# EAGLE design Кроватная подсветка3 (EAGLE 6.1)
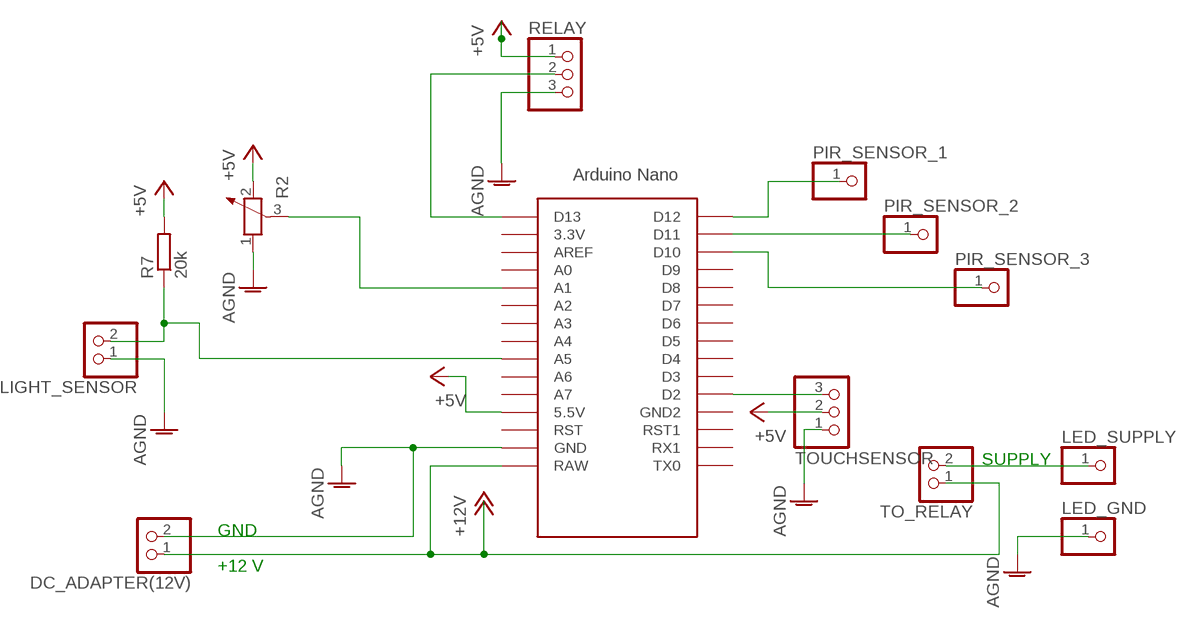
[diagram p0: schematic, sheet 1]

## Parts
DC_ADAPTER(12V)  PINHD-1X2  [1X02]
LED_GND  PINHD-1X1  [1X01]
LED_SUPPLY  PINHD-1X1  [1X01]
LIGHT_SENSOR  PINHD-1X2  [1X02]
PIR_SENSOR_1  PINHD-1X1  [1X01]
PIR_SENSOR_2  PINHD-1X1  [1X01]
PIR_SENSOR_3  PINHD-1X1  [1X01]
R2  POTENTIOMETER_PT-10S  [PT-10S]
R7  20k  R-EU_0207/10  [0207/10]
RELAY  PINHD-1X3  [1X03]
TO_RELAY  PINHD-1X2  [1X02]
TOUCHSENSOR  PINHD-1X3  [1X03]
U$1  NANO  [NANO]

## Nets
+5V: R2.2 R7.2 RELAY.1 TOUCHSENSOR.2 U$1.5V(5.5V)
AGND: DC_ADAPTER(12V).2 LED_GND.1 LIGHT_SENSOR.1 R2.1 RELAY.3 TOUCHSENSOR.1 U$1.GND
N$1: LIGHT_SENSOR.2 R7.1 U$1.A5
N$2: PIR_SENSOR_1.1 U$1.D12
N$3: RELAY.2 U$1.D13
N$4: TOUCHSENSOR.3 U$1.D2
N$5: LED_SUPPLY.1 TO_RELAY.2
N$6: DC_ADAPTER(12V).1 TO_RELAY.1 U$1.RAW
N$7: PIR_SENSOR_2.1 U$1.D11
N$10: PIR_SENSOR_3.1 U$1.D10
N$11: R2.3 U$1.A1
Unconnected: U$1.3.3V U$1.A0 U$1.A2 U$1.A3 U$1.A4 U$1.A6 U$1.A7 U$1.AREF U$1.D3 U$1.D4 U$1.D5 U$1.D6 U$1.D7 U$1.D8 U$1.D9 U$1.GND1(GND2) U$1.ICSP1 U$1.ICSP2 U$1.ICSP3 U$1.ICSP4 U$1.ICSP5 U$1.ICSP6 U$1.RST U$1.RST1 U$1.RX1 U$1.TX0

## Notes on the sheet
- SUPPLY
- GND
- +12 V

## Library data of the parts
DC_ADAPTER(12V) LIGHT_SENSOR TO_RELAY = pinhead:PINHD-1X2: PIN HEADER
LED_GND LED_SUPPLY PIR_SENSOR_1-PIR_SENSOR_3 = pinhead:PINHD-1X1: PIN HEADER
R2 = rcl:POTENTIOMETER_: Potentiometer
R7 = resistor:R-EU_: RESISTOR, European symbol
RELAY TOUCHSENSOR = pinhead:PINHD-1X3: PIN HEADER
U$1 = Arduino-clone:NANO: Arduino Nano

## Board
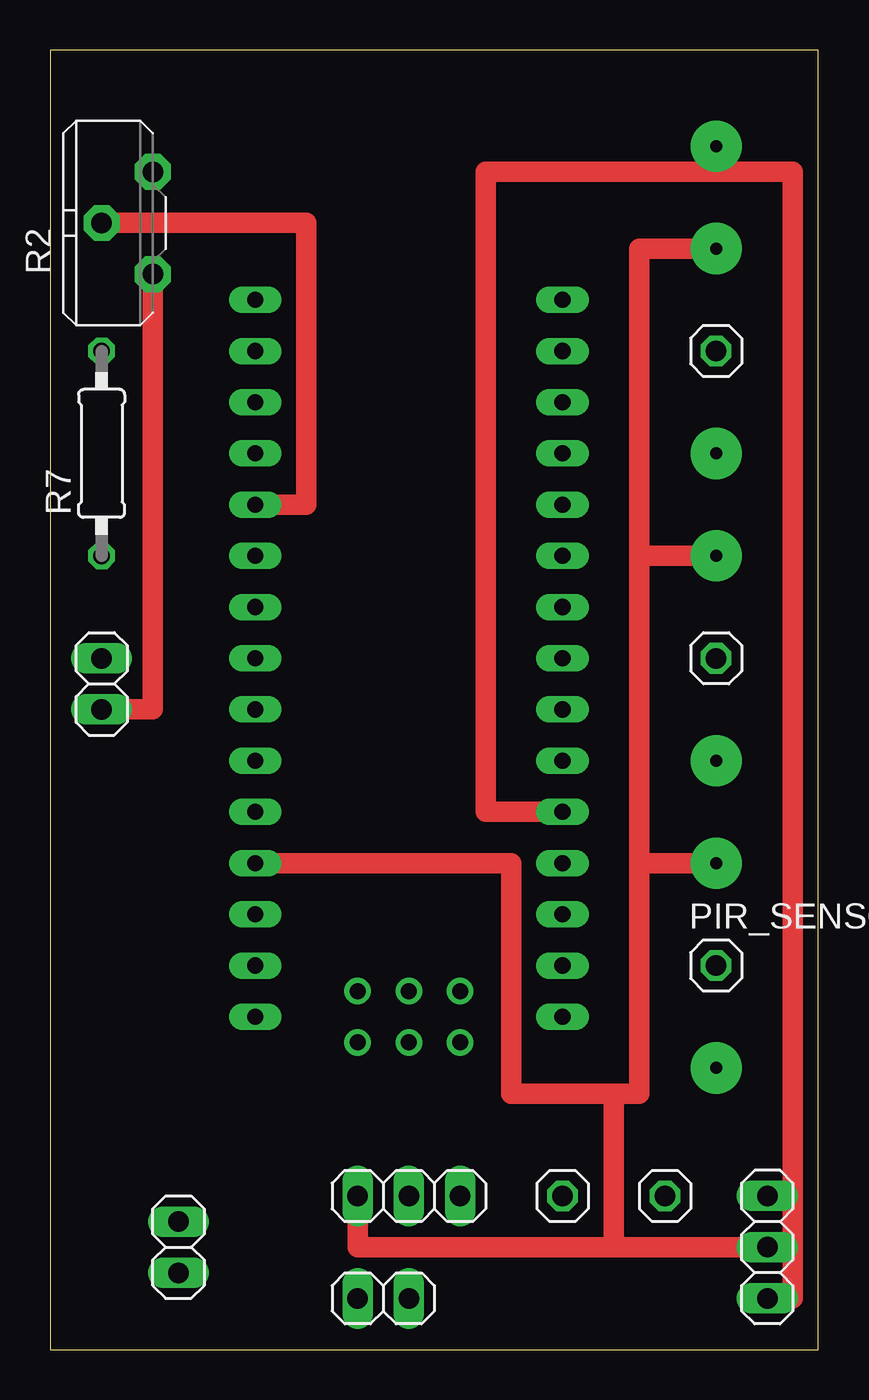
[diagram p1: board, top side]
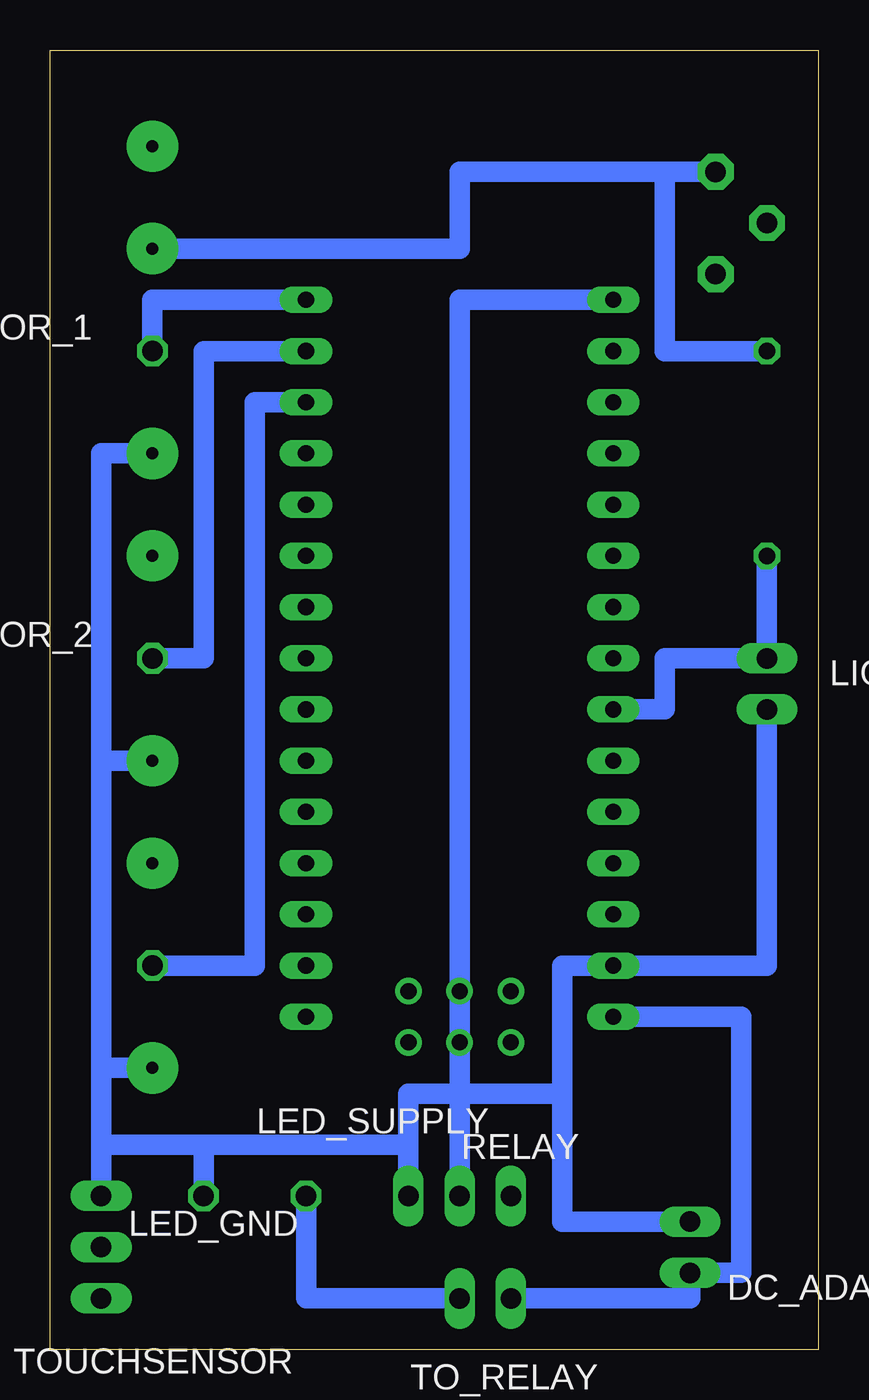
[diagram p2: board, bottom side, seen from below]

Size 38.08 x 64.44 mm. Coordinates in mm from the lower left corner, seen from the top.
Outline: 0,0 38.08,0 38.08,64.44 0,64.44 0,0
Copper layers (1*16): Top 0.035mm / dielectric 1.5mm / Bottom 0.035mm
Design rules: minimum track width 10mil, minimum drill 24mil, track to track 8mil, track to pad 8mil, pad to pad 8mil, via to via 8mil, smd to smd 8mil, copper to edge 40mil, drill to drill 8mil, minimum pad ring 10mil, minimum via ring 8mil, stop-mask expansion 4mil, vias tented up to drill 0mil, thermal gap 10mil

### Footprints (pad centres in the part's own frame; a part is rotated, then mirrored left to right if it is on the bottom)
1X02 = drill 1.016 long: 1 -1.27,0; 2 1.27,0
1X01 = drill 1.016 octagon: 1 0,0
PT-10S = drill 1.016 pad 1.778 octagon: 1 -2.54,-1.27; 2 2.54,-1.27; 3 0,1.27
0207/10 = drill 0.813 octagon: 1 -5.08,0; 2 5.08,0
1X03 = drill 1.016 long: 1 -2.54,0; 2 0,0; 3 2.54,0
NANO = drill 0.8 long: 3.3V -10.16,24.13; 5V -10.16,-1.27; A0 -10.16,19.05; A1 -10.16,16.51; A2 -10.16,13.97; A3 -10.16,11.43; A4 -10.16,8.89; A5 -10.16,6.35; A6 -10.16,3.81; A7 -10.16,1.27; AREF -10.16,21.59; D2 5.08,1.27; D3 5.08,3.81; D4 5.08,6.35; D5 5.08,8.89; D6 5.08,11.43; D7 5.08,13.97; D8 5.08,16.51; D9 5.08,19.05; D10 5.08,21.59; D11 5.08,24.13; D12 5.08,26.67; D13 -10.16,26.67; GND -10.16,-6.35; GND1 5.08,-1.27; RAW -10.16,-8.89; RST -10.16,-3.81; RST1 5.08,-3.81; RX1 5.08,-6.35; TX0 5.08,-8.89 | drill 0.8: ICSP1 -5.08,-10.16; ICSP2 -5.08,-7.62; ICSP3 -2.54,-10.16; ICSP4 -2.54,-7.62; ICSP5 0,-10.16; ICSP6 0,-7.62

### Placement (x,y rotation side)
DC_ADAPTER(12V)  6.35,5.08 90 top
LED_GND  30.48,7.62 0 top
LED_SUPPLY  25.4,7.62 0 top
LIGHT_SENSOR  2.54,33.02 90 top
PIR_SENSOR_1  33.02,49.53 0 top
PIR_SENSOR_2  33.02,34.29 0 top
PIR_SENSOR_3  33.02,19.05 0 top
R2  3.81,55.88 90 top
R7  2.54,44.45 90 top
RELAY  17.78,7.62 0 top
TO_RELAY  16.51,2.54 0 top
TOUCHSENSOR  35.56,5.08 270 top
U$1  20.32,25.4 0 top

### Tracks (layer width: path | path; a pad name or v marks a point on that pad's centre or on a via)
+5V  (via drill 0.6 pad 2.54)
  Top 1.016: 29.21,39.37 29.21,54.61 v33.02,54.61 | 29.21,39.37 29.21,24.13 | 29.21,24.13 29.21,12.7 27.94,12.7 | 27.94,12.7 22.86,12.7 22.86,24.13 U$1.5V | RELAY.1 15.24,5.08 27.94,5.08 | 27.94,5.08 27.94,12.7 | v33.02,24.13 29.21,24.13 | v33.02,39.37 29.21,39.37 | TOUCHSENSOR.2 27.94,5.08
  Bottom 1.016: R7.2 7.62,49.53 7.62,58.42 | R2.2 7.62,58.42 | 7.62,58.42 17.78,58.42 17.78,54.61 v33.02,54.61
AGND  (via drill 0.6 pad 2.54)
  Top 1.016: R2.1 5.08,31.75 LIGHT_SENSOR.1
  Bottom 1.016: 12.7,12.7 12.7,19.05 U$1.GND 2.54,19.05 LIGHT_SENSOR.1 | 12.7,12.7 12.7,6.35 DC_ADAPTER(12V).2 | RELAY.3 20.32,10.16 | 12.7,12.7 20.32,12.7 20.32,10.16 | 20.32,10.16 30.48,10.16 | 30.48,10.16 35.56,10.16 | 35.56,10.16 35.56,13.97 | 35.56,13.97 35.56,29.21 | 35.56,29.21 35.56,44.45 v33.02,44.45 | v33.02,13.97 35.56,13.97 | v33.02,29.21 35.56,29.21 | LED_GND.1 30.48,10.16 | TOUCHSENSOR.1 35.56,10.16
N$1
  Bottom 1.016: R7.1 LIGHT_SENSOR.2 7.62,34.29 7.62,31.75 U$1.A5
N$2
  Bottom 1.016: PIR_SENSOR_1.1 33.02,52.07 U$1.D12
N$3
  Bottom 1.016: U$1.D13 17.78,52.07 RELAY.2
N$4
  Top 1.016: U$1.D2 21.59,26.67 21.59,58.42 36.83,58.42 36.83,2.54 TOUCHSENSOR.3
N$5
  Bottom 1.016: TO_RELAY.2 25.4,2.54 LED_SUPPLY.1
N$6
  Bottom 1.016: TO_RELAY.1 6.35,2.54 DC_ADAPTER(12V).1 3.81,3.81 3.81,16.51 U$1.RAW
N$7
  Bottom 1.016: U$1.D11 30.48,49.53 30.48,34.29 PIR_SENSOR_2.1
N$10
  Bottom 1.016: PIR_SENSOR_3.1 27.94,19.05 27.94,46.99 U$1.D10
N$11
  Top 1.016: R2.3 12.7,55.88 12.7,41.91 U$1.A1
N$15  (via drill 0.6 pad 2.54)
  other vias: 33.02,59.69

### Text on the board
bDocu: GND | NC | +5V | GND | LIGHT_SENSOR | GND | +5V | +5V | GND | GND | +12V